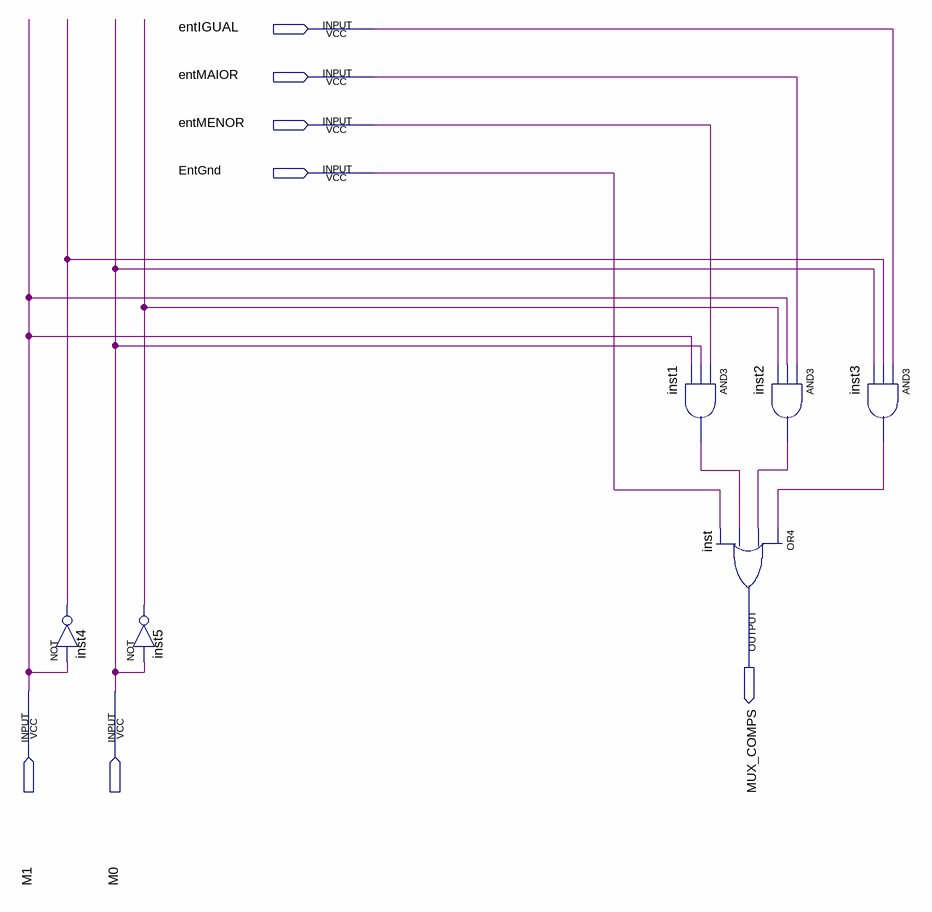
[diagram p0: schematic sheet]
// Quartus schematic MUX_COMP.bdf as structural Verilog: 6 symbols, 7 pins
module MUX_COMP (
  input  entIGUAL,
  input  entMAIOR,
  input  entMENOR,
  input  EntGnd,
  input  M1,
  input  M0,
  output MUX_COMPS
);

  wire inst1_out, inst2_out, inst3_out, inst4_out, inst5_out;

  not inst4 (inst4_out, M1);
  not inst5 (inst5_out, M0);
  and inst1 (inst1_out, entMENOR, M0, M1);
  or inst (MUX_COMPS, inst3_out, inst2_out, inst1_out, EntGnd);
  and inst2 (inst2_out, entMAIOR, M1, inst5_out);
  and inst3 (inst3_out, entIGUAL, inst4_out, M0);
endmodule
